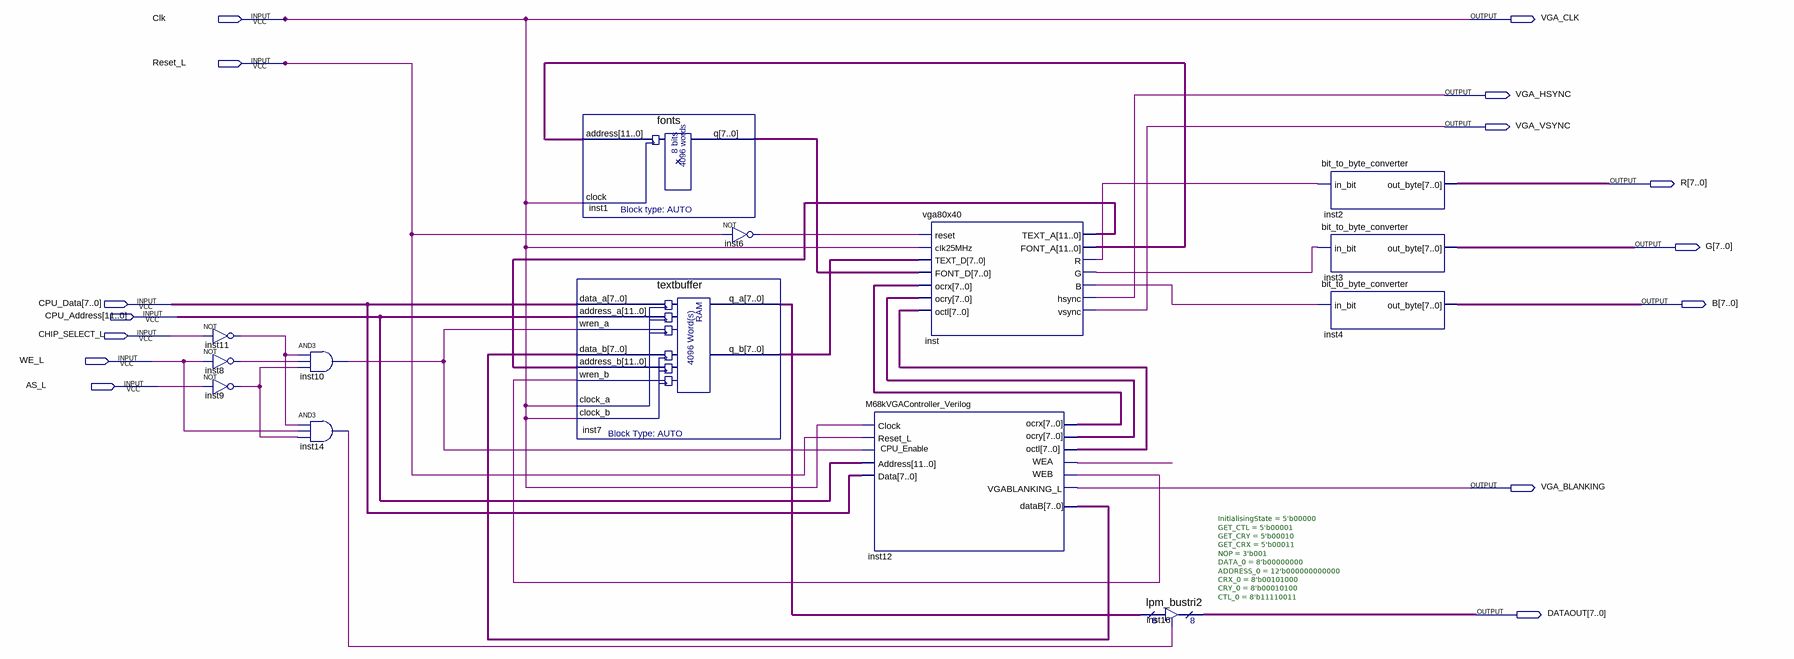
[diagram p0: schematic sheet]
// Quartus schematic VGA_model.bdf as structural Verilog: 14 symbols, 15 pins
module VGA_model (
  input  Clk,
  input  Reset_L,
  input  [7:0] CPU_Data,
  input  [11:0] CPU_Address,
  input  CHIP_SELECT_L,
  input  WE_L,
  input  AS_L,
  output VGA_CLK,
  output VGA_HSYNC,
  output VGA_VSYNC,
  output [7:0] R,
  output [7:0] G,
  output [7:0] B,
  output VGA_BLANKING,
  output [7:0] DATAOUT
);

  wire inst6_out, inst8_out, inst9_out, inst10_out, inst11_out, inst12_wea, inst12_web, inst14_out, inst_b,
       inst_g, inst_r;
  wire [7:0] inst1_q, inst7_q_a, inst7_q_b, inst12_datab, inst12_ocrx, inst12_ocry, inst12_octl;
  wire [11:0] inst_font_a, inst_text_a;

  not inst11 (inst11_out, CHIP_SELECT_L);
  not inst8 (inst8_out, WE_L);
  not inst9 (inst9_out, AS_L);
  and inst10 (inst10_out, inst11_out, inst8_out, inst9_out);
  and inst14 (inst14_out, inst11_out, WE_L, inst9_out);
  fonts inst1 (.address(inst_font_a), .clock(Clk), .q(inst1_q));
  textbuffer inst7 (
    .data_a(CPU_Data), .address_a(CPU_Address), .wren_a(inst10_out), .data_b(inst12_datab),
    .address_b(inst_text_a), .wren_b(inst12_web), .clock_a(Clk), .clock_b(Clk), .q_a(inst7_q_a),
    .q_b(inst7_q_b));
  not inst6 (inst6_out, Reset_L);
  M68kVGAController_Verilog #(.InitialisingState(5'b00000), .GET_CTL(5'b00001), .GET_CRY(5'b00010), .GET_CRX(5'b00011), .NOP(3'b001), .DATA_0(8'b00000000), .ADDRESS_0(12'b000000000000), .CRX_0(8'b00101000), .CRY_0(8'b00010100), .CTL_0(8'b11110011)) inst12 (
    .Clock(Clk), .Reset_L(Reset_L), .Address(CPU_Address), .Data(CPU_Data), .CPU_Enable(inst10_out),
    .VGABLANKING_L(VGA_BLANKING), .ocrx(inst12_ocrx), .ocry(inst12_ocry), .octl(inst12_octl),
    .WEA(inst12_wea), .WEB(inst12_web), .dataB(inst12_datab));
  vga80x40 inst (
    .reset(inst6_out), .clk25MHz(Clk), .TEXT_D(inst7_q_b), .FONT_D(inst1_q), .ocrx(inst12_ocrx),
    .ocry(inst12_ocry), .octl(inst12_octl), .TEXT_A(inst_text_a), .FONT_A(inst_font_a), .R(inst_r),
    .G(inst_g), .B(inst_b), .hsync(VGA_HSYNC), .vsync(VGA_VSYNC));
  lpm_bustri2 inst16 (.enabledt(inst14_out), .data(inst7_q_a), .tridata(DATAOUT));
  bit_to_byte_converter inst2 (.in_bit(inst_r), .out_byte(R));
  bit_to_byte_converter inst3 (.in_bit(inst_g), .out_byte(G));
  bit_to_byte_converter inst4 (.in_bit(inst_b), .out_byte(B));

  assign VGA_CLK = Clk;
endmodule
